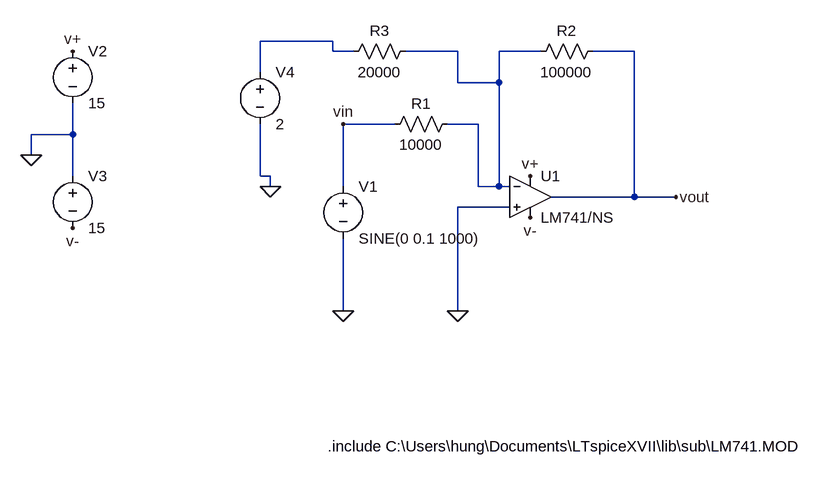
[diagram p0: schematic part 4.asc]
part 4.asc, the LTspice schematic file:
Version 4
SHEET 1 880 680
WIRE -32 -32 -144 -32
WIRE -32 -16 -32 -32
WIRE 0 -16 -32 -16
WIRE 160 -16 80 -16
WIRE 288 -16 224 -16
WIRE 432 -16 368 -16
WIRE -144 16 -144 -32
WIRE 160 32 160 -16
WIRE 224 32 224 -16
WIRE 224 32 160 32
WIRE 64 96 -16 96
WIRE 192 96 144 96
WIRE -432 112 -432 64
WIRE -432 112 -496 112
WIRE -496 144 -496 112
WIRE -432 176 -432 112
WIRE -144 176 -144 96
WIRE -128 176 -144 176
WIRE -128 192 -128 176
WIRE -16 192 -16 96
WIRE 192 192 192 96
WIRE 224 192 224 32
WIRE 224 192 192 192
WIRE 240 192 224 192
WIRE 432 208 432 -16
WIRE 432 208 304 208
WIRE 496 208 432 208
WIRE 240 224 160 224
WIRE -16 384 -16 272
WIRE 160 384 160 224
FLAG 160 384 0
FLAG -16 384 0
FLAG -496 144 0
FLAG -432 256 v-
FLAG 272 240 v-
FLAG -432 -16 v+
FLAG 272 176 v+
FLAG -16 96 vin
FLAG 496 208 vout
FLAG -128 192 0
SYMBOL Opamps\\opamp2 272 144 R0
SYMATTR InstName U1
SYMATTR Value LM741/NS
SYMBOL voltage -16 176 R0
WINDOW 123 0 0 Left 0
WINDOW 39 0 0 Left 0
SYMATTR InstName V1
SYMATTR Value SINE(0 0.1 1000)
SYMBOL voltage -432 -32 R0
WINDOW 123 0 0 Left 0
WINDOW 39 0 0 Left 0
SYMATTR InstName V2
SYMATTR Value 15
SYMBOL voltage -432 160 R0
WINDOW 123 0 0 Left 0
WINDOW 39 0 0 Left 0
SYMATTR InstName V3
SYMATTR Value 15
SYMBOL res 160 80 R90
WINDOW 0 0 56 VBottom 2
WINDOW 3 32 56 VTop 2
SYMATTR InstName R1
SYMATTR Value 10000
SYMBOL res 384 -32 R90
WINDOW 0 0 56 VBottom 2
WINDOW 3 32 56 VTop 2
SYMATTR InstName R2
SYMATTR Value 100000
SYMBOL voltage -144 0 R0
WINDOW 123 0 0 Left 0
WINDOW 39 0 0 Left 0
SYMATTR InstName V4
SYMATTR Value 2
SYMBOL res 96 -32 R90
WINDOW 0 0 56 VBottom 2
WINDOW 3 32 56 VTop 2
SYMATTR InstName R3
SYMATTR Value 20000
TEXT -40 592 Left 2 !.include C:\\Users\\hung\\Documents\\LTspiceXVII\\lib\\sub\\LM741.MOD

The netlist it stands for:
* part 4.asc
XU1 0 N002 v+ v- vout LM741/NS  ; pins In+ In- V+ V- OUT
V1 vin 0 SINE(0 0.1 1000)
V2 v+ 0 15
V3 0 v- 15
R1 N002 vin 10000
R2 vout N002 100000
V4 N001 0 2
R3 N002 N001 20000
.include C:\Users\hung\Documents\LTspiceXVII\lib\sub\LM741.MOD
.backanno
.end